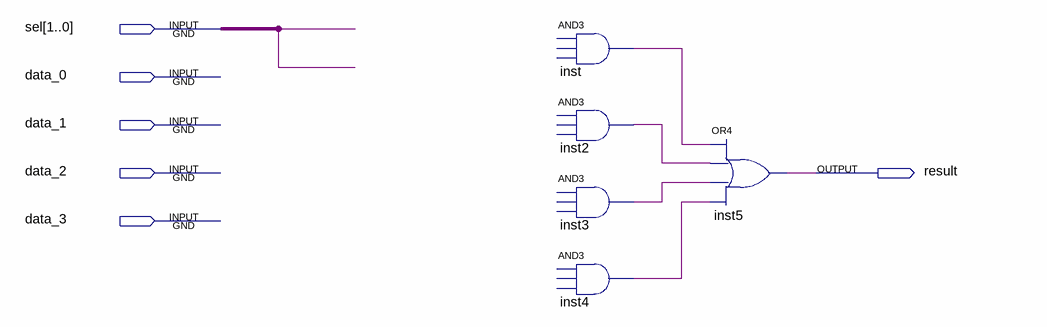
[diagram p0: schematic sheet]
// Quartus schematic mux1.bdf as structural Verilog: 5 symbols, 6 pins
module mux1 (
  input  [1:0] sel,
  input  data_0,
  input  data_1,
  input  data_2,
  input  data_3,
  output result
);

  wire inst2_out, inst3_out, inst4_out, inst_out;

  // AND3 inst has open pins: IN1=open, IN2=open, IN3=open, OUT=inst_out
  // AND3 inst2 has open pins: IN1=open, IN2=open, IN3=open, OUT=inst2_out
  // AND3 inst3 has open pins: IN1=open, IN2=open, IN3=open, OUT=inst3_out
  // AND3 inst4 has open pins: IN1=open, IN2=open, IN3=open, OUT=inst4_out
  or inst5 (result, inst_out, inst2_out, inst3_out, inst4_out);
endmodule
